# Altium schematic sheet SCore-SR1_2024-11-10.schdoc
size 406 x 260 mm
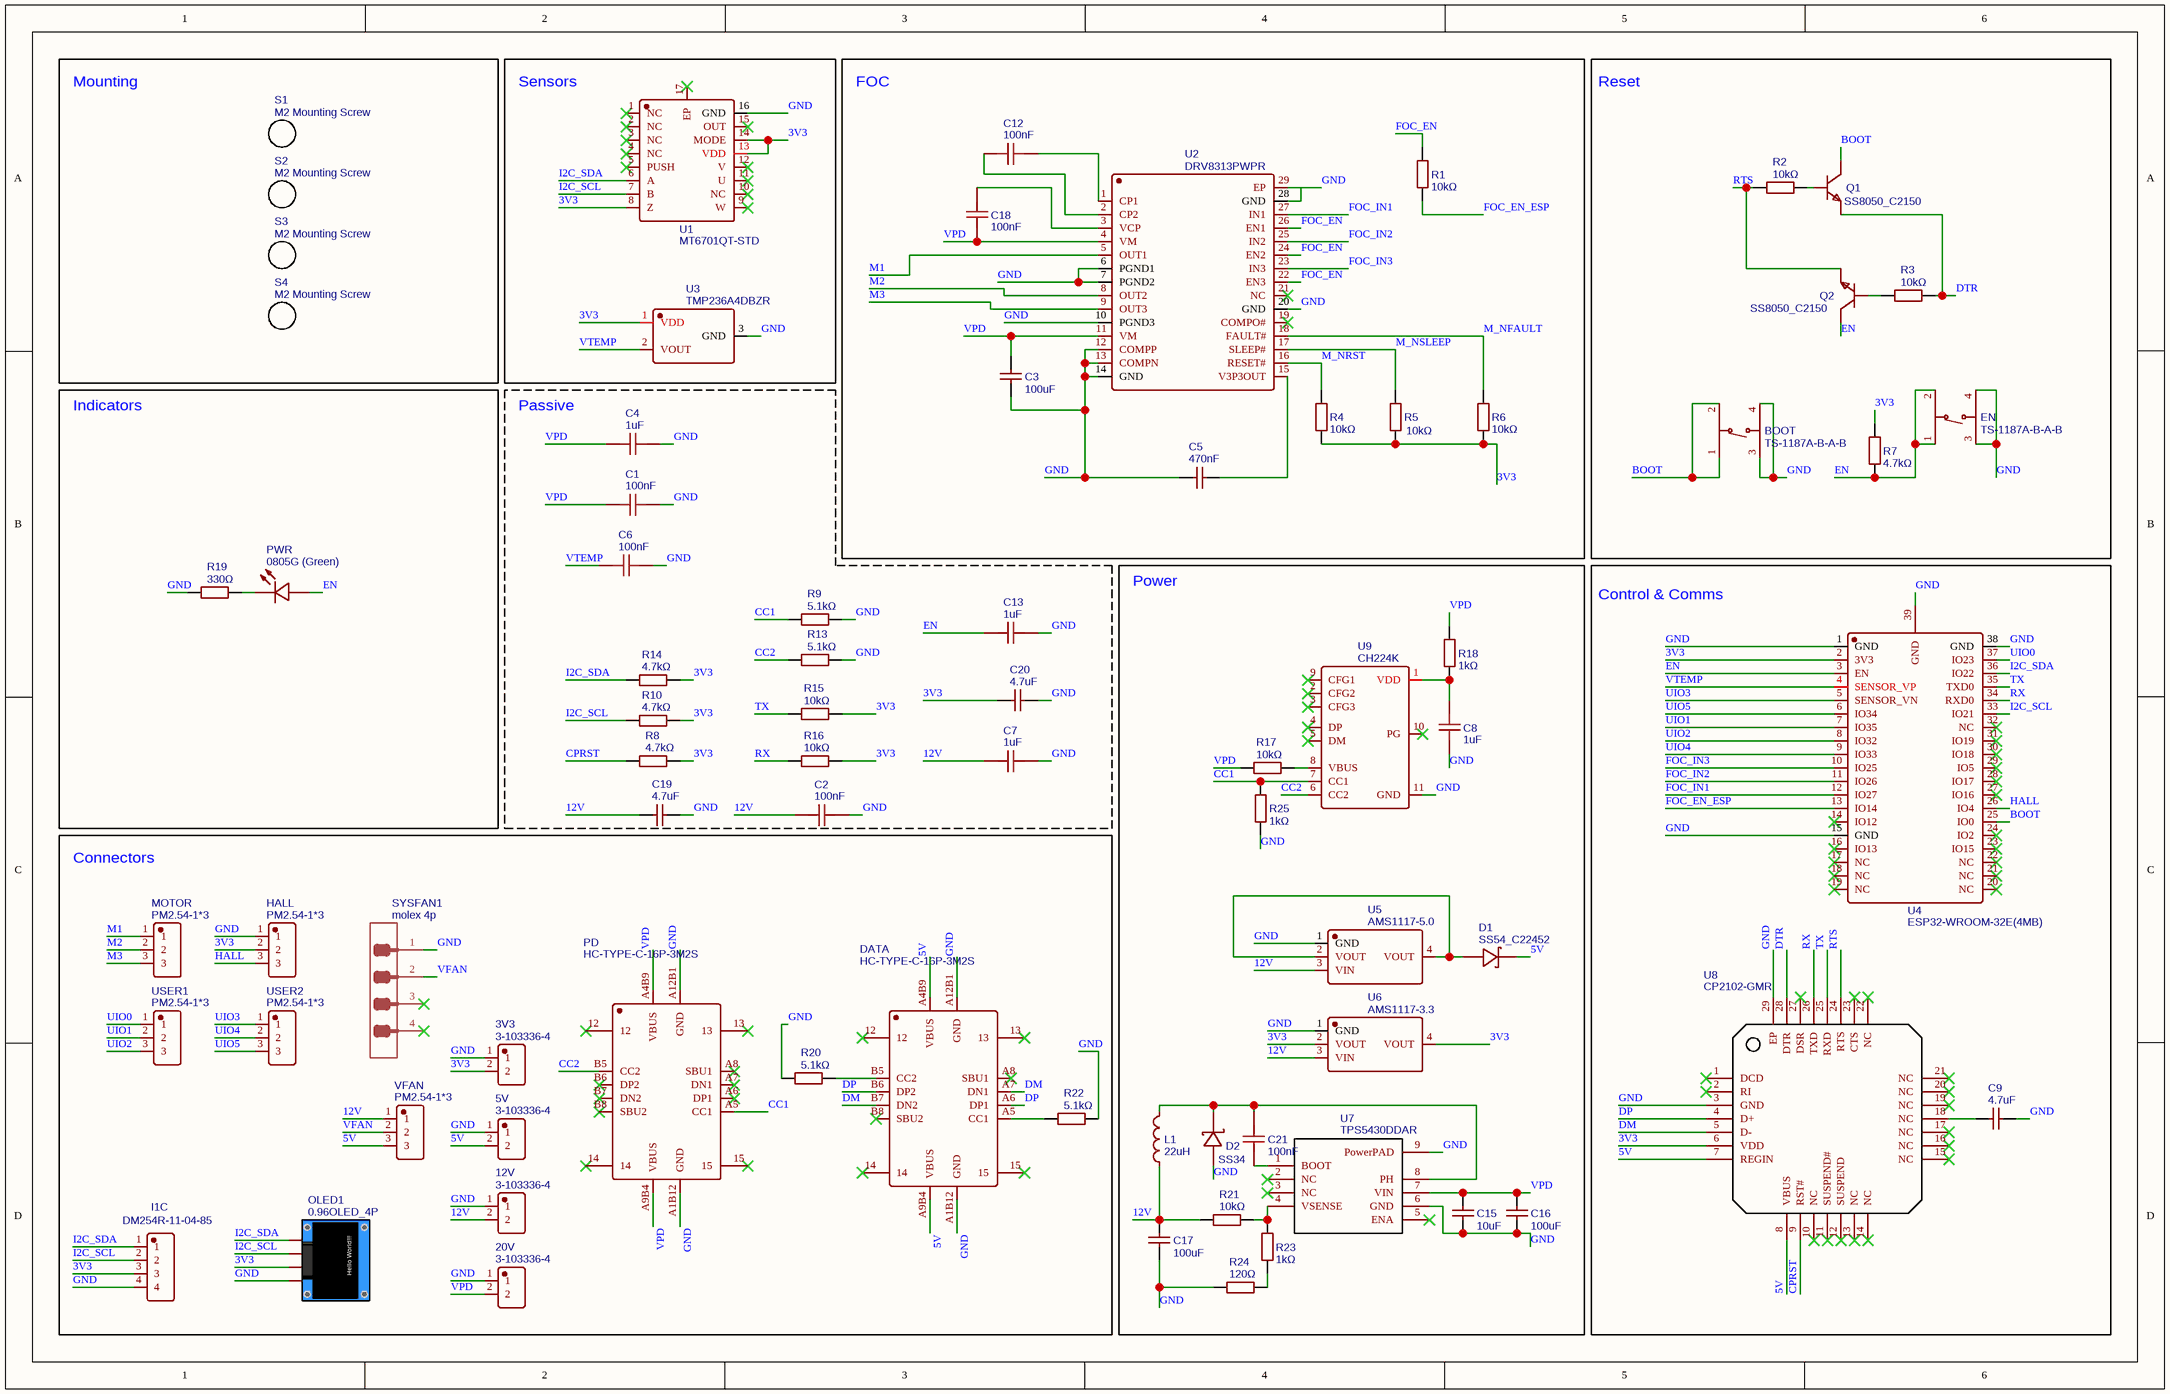
[diagram p0: SCore-SR1_2024-11-10.schdoc]

## Parts
3V3  3-103336-4  [HDR-TH_2P-P2.54-V-M-1]
5V  3-103336-4  [HDR-TH_2P-P2.54-V-M-1]
12V  3-103336-4  [HDR-TH_2P-P2.54-V-M-1]
20V  3-103336-4  [HDR-TH_2P-P2.54-V-M-1]
BOOT  TS-1187A-B-A-B  [SW-SMD_4P-L5.1-W5.1-P3.70-LS6.5-TL-2]
C1  100nF  [C0603]
C2  100nF  [C0603]
C3  100uF  [C1206]
C4  1uF  [C0603]
C5  470nF  [C0805]
C6  100nF  [C0603]
C7  1uF  [C0603]
C8  1uF  [C0603]
C9  4.7uF  [C0805]
C12  100nF  [C0603]
C13  1uF  [C0603]
C15  10uF  [C1206]
C16  100uF  [C1206]
C17  100uF  [C1206]
C18  100nF  [C0603]
C19  4.7uF  [C0805]
C20  4.7uF  [C0805]
C21  100nF  [C0603]
D1  SS54_C22452  [SMA_L4.4-W2.8-LS5.4-R-RD]
D2  SS34  [SMA_L4.3-W2.6-LS5.2-RD]
DATA  HC-TYPE-C-16P-3M2S  [USB-C-SMD_HC-TYPE-C-16P-026W]
EN  TS-1187A-B-A-B  [SW-SMD_4P-L5.1-W5.1-P3.70-LS6.5-TL-2]
HALL  PM2.54-1*3  [HDR-TH_3P-P2.54-V-F]
I1C  DM254R-11-04-85  [HDR-TH_4P-P2.54-V-F]
L1  22uH  [IND-SMD_L4.0-W4.0_PRS4018]
MOTOR  PM2.54-1*3  [HDR-TH_3P-P2.54-V-F]
OLED1  0.96OLED_4P  [HDR-TH_4P-P2.54-V-F-3]
PD  HC-TYPE-C-16P-3M2S  [USB-C-SMD_HC-TYPE-C-16P-026W]
PWR  0805G (Green)  [LED0805-R-RD]
Q1  SS8050_C2150  [SOT-23-3_L2.9-W1.3-P1.90-LS2.4-BR]
Q2  SS8050_C2150  [SOT-23-3_L2.9-W1.3-P1.90-LS2.4-BR]
R1  10kΩ  [R0603]
R2  10kΩ  [R1206]
R3  10kΩ  [R1206]
R4  10kΩ  [R0603]
R5  10kΩ  [R0603]
R6  10kΩ  [R0603]
R7  4.7kΩ  [R0805]
R8  4.7kΩ  [R0805]
R9  5.1kΩ  [R0603]
R10  4.7kΩ  [R0805]
R13  5.1kΩ  [R0603]
R14  4.7kΩ  [R0805]
R15  10kΩ  [R0603]
R16  10kΩ  [R0603]
R17  10kΩ  [R0603]
R18  1kΩ  [R0402]
R19  330Ω  [R0805]
R20  5.1kΩ  [R0603]
R21  10kΩ  [R0805]
R22  5.1kΩ  [R0603]
R23  1kΩ  [R0402]
R24  120Ω  [R0805]
R25  1kΩ  [R0402]
S1  M2 Mounting Screw  [MOUNTINGHOLE_2.2MM_M2_PAD]
S2  M2 Mounting Screw  [MOUNTINGHOLE_2.2MM_M2_PAD]
S3  M2 Mounting Screw  [MOUNTINGHOLE_2.2MM_M2_PAD]
S4  M2 Mounting Screw  [MOUNTINGHOLE_2.2MM_M2_PAD]
SYSFAN1  molex 4p  [MOLEX---47053-1000_MOLEX]
U1  MT6701QT-STD  [QFN-16_L3.0-W3.0-P0.50-TL-EP]
U2  DRV8313PWPR  [HTSSOP-28_L9.8-W4.5-P0.65-LS6.6-BL-EP]
U3  TMP236A4DBZR  [SOT-23-3_L2.9-W1.3-P1.90-LS2.4-BR]
U4  ESP32-WROOM-32E(4MB)  [WIFI-SMD_ESP32-WROOM-32E]
U5  AMS1117-5.0  [SOT-223_L6.5-W3.5-P2.30-LS7.0-BR]
U6  AMS1117-3.3  [SOT-223-3_L6.5-W3.4-P2.30-LS7.0-BR]
U7  TPS5430DDAR  [ESOP-8_L4.9-W3.9-P1.27-LS6.0-TL-EP]
U8  CP2102-GMR  [WQFN-28_L5.0-W5.0-P0.50-BL-EP3.2]
U9  CH224K  [ESSOP-10_L4.9-W3.9-P1.0-LS6.0-TL-EP]
USER1  PM2.54-1*3  [HDR-TH_3P-P2.54-V-F]
USER2  PM2.54-1*3  [HDR-TH_3P-P2.54-V-F]
VFAN  PM2.54-1*3  [HDR-TH_3P-P2.54-V-F]

## Blocks framed on the sheet
Mounting: S1-S4
Sensors: U1 U3
FOC: C3 C5 C12 C18 R1 R4-R6 U2
Reset: BOOT EN Q1 Q2 R2 R3 R7
Indicators: PWR R19
Passive: C1 C2 C4 C6 C7 C13 C19 C20 R8-R10 R13-R16
Power: C8 C15-C17 C21 D1 D2 L1 R17 R18 R21 R23-R25 U5-U7 U9
Control & Comms: C9 U4 U8
Connectors: 3V3 5V 12V 20V DATA HALL I1C MOTOR OLED1 PD R20 R22 SYSFAN1 USER1 USER2 VFAN

## Nets
3V3: 3V3.2 C20.1 HALL.2 I1C.3 OLED1.3 R4.1 R5.1 R6.1 R7.2 R8.1 R10.1 R14.1 R15.1 R16.1 U1.8(Z) U1.13(VDD) U1.14(MODE) U3.1(VDD) U4.2(3V3) U6.2(VOUT) U6.4(VOUT) U8.6(VDD)
5V: 5V.2 D1.2(K) DATA.A4B9(VBUS) DATA.A9B4(VBUS) U8.7(REGIN) U8.8(VBUS) VFAN.3
12V: 12V.2 C2.1 C7.1 C17.2 C19.1 L1.1 R21.2 U5.3(VIN) U6.3(VIN) VFAN.1
BOOT: BOOT.1(A) BOOT.2(B) Q1.3(C) U4.25(IO0)
CC1: PD.A5(CC1) R9.1 R25.2 U9.7(CC1)
CC2: PD.B5(CC2) R13.1 U9.6(CC2)
CPRST: R8.2 U8.9(RST#)
DM: DATA.A7(DN1) DATA.B7(DN2) U8.5(D-)
DP: DATA.A6(DP1) DATA.B6(DP2) U8.4(D+)
DTR: Q1.2(E) R3.2 U8.28(DTR)
EN: C13.1 EN.1(A) EN.2(B) PWR.1(A) Q2.3(C) R7.1 U4.3(EN)
FOC_EN: R1.2 U2.22(EN3) U2.24(EN2) U2.26(EN1)
FOC_EN_ESP: R1.1 U4.13(IO14)
FOC_IN1: U2.27(IN1) U4.12(IO27)
FOC_IN2: U2.25(IN2) U4.11(IO26)
FOC_IN3: U2.23(IN3) U4.10(IO25)
GND: 3V3.1 5V.1 12V.1 20V.1 BOOT.3(C) BOOT.4(D) C1.2 C2.2 C3.1 C4.2 C5.1 C6.2 C7.2 C8.1 C9.2 C13.2 C15.1 C16.1 C17.1 C19.2 C20.2 D2.2(A) DATA.A1B12(GND) DATA.A12B1(GND) EN.3(C) EN.4(D) HALL.1 I1C.4 OLED1.4 PD.A1B12(GND) PD.A12B1(GND) R9.2 R13.2 R19.1 R20.1 R22.2 R24.1 R25.1 SYSFAN1.1 U1.16(GND) U2.6(PGND1) U2.7(PGND2) U2.10(PGND3) U2.12(COMPP) U2.13(COMPN) U2.14(GND) U2.20(GND) U2.28(GND) U2.29(EP) U3.3(GND) U4.1(GND) U4.15(GND) U4.38(GND) U4.39(GND) U5.1(GND) U6.1(GND) U7.6(GND) U7.9(PowerPAD) U8.3(GND) U8.29(EP) U9.11(GND)
HALL: HALL.3 U4.26(IO4)
I2C_SCL: I1C.2 OLED1.2 R10.2 U1.7(B) U4.33(IO21)
I2C_SDA: I1C.1 OLED1.1 R14.2 U1.6(A) U4.36(IO22)
M1: MOTOR.1 U2.5(OUT1)
M2: MOTOR.2 U2.8(OUT2)
M3: MOTOR.3 U2.9(OUT3)
M_NFAULT: R6.2 U2.18(FAULT#)
M_NRST: R4.2 U2.16(RESET#)
M_NSLEEP: R5.2 U2.17(SLEEP#)
RTS: Q2.2(E) R2.1 U8.24(RTS)
RX: R16.2 U4.34(RXD0) U8.26(TXD)
TX: R15.2 U4.35(TXD0) U8.25(RXD)
UIO0: U4.37(IO23) USER1.1
UIO1: U4.7(IO35) USER1.2
UIO2: U4.8(IO32) USER1.3
UIO3: U4.5(SENSOR_VN) USER2.1
UIO4: U4.9(IO33) USER2.2
UIO5: U4.6(IO34) USER2.3
VFAN: SYSFAN1.2 VFAN.2
VPD: 20V.2 C1.1 C3.2 C4.1 C15.2 C16.2 C18.1 PD.A4B9(VBUS) PD.A9B4(VBUS) R17.2 R18.2 U2.4(VM) U2.11(VM) U7.7(VIN)
VTEMP: C6.1 U3.2(VOUT) U4.4(SENSOR_VP)
NetC5_2: C5.2 U2.15(V3P3OUT)
NetC8_2: C8.2 R18.1 U9.1(VDD)
NetC9_1: C9.1 U8.18(NC)
NetC12_1: C12.1 U2.2(CP2)
NetC12_2: C12.2 U2.1(CP1)
NetC18_2: C18.2 U2.3(VCP)
NetC21_1: C21.1 D2.1(K) L1.2 U7.8(PH)
NetC21_2: C21.2 U7.1(BOOT)
NetD1_1: D1.1(A) U5.2(VOUT) U5.4(VOUT)
NetDATA_A5: DATA.A5(CC1) R22.1
NetDATA_B5: DATA.B5(CC2) R20.2
NetPWR_2: PWR.2(K) R19.2
NetQ1_1: Q1.1(B) R2.2
NetQ2_1: Q2.1(B) R3.1
NetR17_1: R17.1 U9.8(VBUS)
NetR21_1: R21.1 R23.2 U7.4(VSENSE)
NetR23_1: R23.1 R24.2

Not connected (* = marked no-connect by the designer): DATA 12* 13* 14* 15* A8(SBU1)* B8(SBU2)*; PD 12* 13* 14* 15* A6(DP1)* A7(DN1)* A8(SBU1)* B6(DP2)* B7(DN2)* B8(SBU2)*; SYSFAN1 3* 4*; U1 1(NC)* 2(NC)* 3(NC)* 4(NC)* 5(PUSH)* 9(W)* 10(NC)* 11(U)* 12(V)* 15(OUT)* 17(EP)*; U2 19(COMPO#)* 21(NC)*; U4 14(IO12)* 16(IO13)* 17(NC)* 18(NC)* 19(NC)* 20(NC)* 21(NC)* 22(NC)* 23(IO15)* 24(IO2)* 27(IO16)* 28(IO17)* 29(IO5)* 30(IO18)* 31(IO19)* 32(NC)*; U7 2(NC)* 3(NC)* 5(ENA)*; U8 1(DCD)* 2(RI)* 10(NC)* 11(SUSPEND#)* 12(SUSPEND)* 13(NC)* 14(NC)* 15(NC)* 16(NC)* 17(NC)* 19(NC)* 20(NC)* 21(NC)* 22(NC)* 23(CTS)* 27(DSR)*; U9 2(CFG2)* 3(CFG3)* 4(DP)* 5(DM)* 9(CFG1)* 10(PG)*

## Notes on the sheet
- (in symbol 0.96OLED_4P) Hello World!!!

## Library data of the parts
3V3 5V 12V 20V = 3-103336-4: Manufacturer: TE Connectivity(泰科电子); Contributor: lcsc; Supplier: LCSC; Supplier Part: C6802999; Manufacturer Part: 3-103336-4; spicePre: U; spiceSymbolName: 3-103336-4
BOOT EN = TS-1187A-B-A-B: Manufacturer: XKB Connectivity(中国星坤); Contributor: LCSC; Supplier: LCSC; Supplier Part: C318884; Manufacturer Part: TS-1187A-B-A-B; JLCPCB Part Class: Basic Part; spicePre: S; spiceSymbolName: TS-1187A-B-A-B
C1 C2 C6 C12 C18 C21 = 100nF: Manufacturer: YAGEO(国巨); Manufacturer Part: CC0603KRX7R9BB104; nameAlias: Value; Supplier: LCSC; Supplier Part: C14663; JLCPCB Part Class: Basic Part; spicePre: C; spiceSymbolName: CC0603KRX7R9BB104
C3 C16 C17 = 100uF: Manufacturer Part: CL31A107MQHNNNE; Manufacturer: SAMSUNG(三星); nameAlias: Value; Supplier: LCSC; Supplier Part: C15008; JLCPCB Part Class: Basic Part; spicePre: C; spiceSymbolName: CL31A107MQHNNNE
C4 C7 C8 C13 = 1uF: Manufacturer Part: CL10A105KB8NNNC; Manufacturer: SAMSUNG(三星); nameAlias: Value; Supplier: LCSC; Supplier Part: C15849; JLCPCB Part Class: Basic Part; spicePre: C; spiceSymbolName: CL10A105KB8NNNC
C5 = 470nF: Manufacturer Part: CL21B474KBFNNNE; Manufacturer: SAMSUNG(三星); nameAlias: Capacitance; Contributor: eisendev; Supplier: LCSC; Supplier Part: C13967; JLCPCB Part Class: Basic Part; spicePre: C; spiceSymbolName: CL21B474KBFNNNE
C9 C19 C20 = 4.7uF: Manufacturer Part: CL21A475KAQNNNE; Manufacturer: SAMSUNG(三星); nameAlias: Value; Supplier: LCSC; Supplier Part: C1779; JLCPCB Part Class: Basic Part; spicePre: C; spiceSymbolName: CL21A475KAQNNNE
C15 = 10uF: Manufacturer Part: CL31A106KBHNNNE; Manufacturer: SAMSUNG(三星); nameAlias: Value; Supplier: LCSC; Supplier Part: C13585; JLCPCB Part Class: Basic Part; spicePre: C; spiceSymbolName: CL31A106KBHNNNE
D1 = SS54_C22452: Manufacturer Part: SS54; Manufacturer: MDD; Contributor: mtz8302; Supplier: LCSC; Supplier Part: C22452; JLCPCB Part Class: Basic Part; link: https://lcsc.com/eda_search?q=C22452&%26type=1&ref=editor; spicePre: D; spiceSymbolName: SS54_C22452
D2 = SS34: Manufacturer: MDD(辰达半导体); Supplier: LCSC; Manufacturer Part: SS34; Supplier Part: C8678; JLCPCB Part Class: Basic Part; spicePre: D; spiceSymbolName: SS34_C8678
DATA PD = HC-TYPE-C-16P-3M2S: Manufacturer: HC(虹成电子); Contributor: lcsc; Supplier: LCSC; Supplier Part: C19274016; Manufacturer Part: HC-TYPE-C-16P-3M2S; JLCPCB Part Class: Extended Part; spicePre: U; spiceSymbolName: HC-TYPE-C-16P-3M2S
HALL MOTOR USER1 USER2 VFAN = PM2.54-1*3: Manufacturer: ZHOURI(洲日); Contributor: lcsc; Supplier: LCSC; Supplier Part: C5116529; Manufacturer Part: PM2.54-1*3; JLCPCB Part Class: Extended Part; spicePre: U; spiceSymbolName: PM2.54-1*3
I1C = DM254R-11-04-85: Manufacturer: DEALON(德艺隆); Contributor: LCSC; Supplier: LCSC; Supplier Part: C2935975; Manufacturer Part: DM254R-11-04-85; JLCPCB Part Class: Extended Part; spicePre: U; spiceSymbolName: DM254R-11-04-85
L1 = 22uH: Manufacturer: FH(风华); Manufacturer Part: PRS4018-220MT; nameAlias: Value; Supplier: LCSC; Supplier Part: C96155; JLCPCB Part Class: Extended Part; spicePre: L; spiceSymbolName: PRS4018-220MT
OLED1 = 0.96OLED_4P: Contributor: LCEDA_Lib; Supplier: LCSC; spicePre: O; spiceSymbolName: 0.96OLED_4P
PWR = 0805G (Green): Manufacturer: KENTO; Manufacturer Part: KT-0805G; Supplier: LCSC; Supplier Part: C2297; JLCPCB Part Class: Basic Part; spicePre: L; spiceSymbolName: 0805G (Green)
Q1 Q2 = SS8050_C2150: Manufacturer: CJ(江苏长电/长晶); Manufacturer Part: SS8050; Supplier: LCSC; Supplier Part: C2150; JLCPCB Part Class: Basic Part; spicePre: Q; spiceSymbolName: SS8050_C2150
R1 R4-R6 R15-R17 = 10kΩ: Manufacturer: UniOhm; Manufacturer Part: 0603WAF4701T5E; nameAlias: Resistance; Resistance (Ohms): 4.7K; Supplier: LCSC; Supplier Part: C23162; JLCPCB Part Class: Basic Part; spicePre: R; spiceSymbolName: 0603WAF4701T5E
R2 R3 = 10kΩ: Manufacturer: UNI-ROYAL(厚声); Manufacturer Part: 1206W4F1002T5E; nameAlias: Value; Supplier: LCSC; Supplier Part: C17902; JLCPCB Part Class: Basic Part; spicePre: R; spiceSymbolName: 1206W4F1002T5E
R7 R8 R10 R14 = 4.7kΩ: Manufacturer: UNI-ROYAL(厚声); Manufacturer Part: 0805W8F4701T5E; nameAlias: Value; Supplier: LCSC; Supplier Part: C17673; JLCPCB Part Class: Basic Part; spicePre: R; spiceSymbolName: 0805W8F4701T5E
R9 R13 R20 R22 = 5.1kΩ: Manufacturer Part: 0603WAF5101T5E; Manufacturer: UNI-ROYAL(厚声); nameAlias: Value; Supplier: LCSC; Supplier Part: C23186; JLCPCB Part Class: Basic Part; spicePre: R; spiceSymbolName: 0603WAF5101T5E
R18 R23 R25 = 1kΩ: Manufacturer: UNI-ROYAL(厚声); Manufacturer Part: 0402WGF1001TCE; nameAlias: Value; Supplier: LCSC; Supplier Part: C11702; JLCPCB Part Class: Basic Part; spicePre: R; spiceSymbolName: 0402WGF1001TCE
R19 = 330Ω: Manufacturer: UNI-ROYAL(厚声); Manufacturer Part: 0805W8F3300T5E; nameAlias: Value; Supplier: LCSC; Supplier Part: C17630; JLCPCB Part Class: Basic Part; spicePre: R; spiceSymbolName: 0805W8F3300T5E
R21 = 10kΩ: Manufacturer: UNI-ROYAL(厚声); Manufacturer Part: 0805W8F1002T5E; nameAlias: Value; Supplier: LCSC; Supplier Part: C17414; JLCPCB Part Class: Basic Part; spicePre: R; spiceSymbolName: 0805W8F1002T5E
R24 = 120Ω: Manufacturer: UNI-ROYAL(厚声); Manufacturer Part: 0805W8F1200T5E; nameAlias: Value; Supplier: LCSC; Supplier Part: C17437; JLCPCB Part Class: Basic Part; spicePre: R; spiceSymbolName: 0805W8F1200T5E
S1-S4 = M2 Mounting Screw: Contributor: Dayat -; spicePre: S; spiceSymbolName: M2 Mounting Screw
SYSFAN1 = molex 4p: Contributor: delil1220; spicePre: J; spiceSymbolName: molex 4p
U1 = MT6701QT-STD: Manufacturer: MagnTek(麦歌恩); Contributor: LCSC; Supplier: LCSC; Supplier Part: C2837232; Manufacturer Part: MT6701QT-STD; JLCPCB Part Class: Extended Part; spicePre: U; spiceSymbolName: MT6701QT-STD
U2 = DRV8313PWPR: Manufacturer: Texas Instruments; Contributor: LCSC; Supplier: LCSC; Supplier Part: C92482; Manufacturer Part: DRV8313PWPR; JLCPCB Part Class: Extended Part; spicePre: U; spiceSymbolName: DRV8313PWPR
U3 = TMP236A4DBZR: Manufacturer: TI(德州仪器); Contributor: LCSC; Supplier: LCSC; Supplier Part: C2872164; Manufacturer Part: TMP236A4DBZR; JLCPCB Part Class: Extended Part; spicePre: U; spiceSymbolName: TMP236A4DBZR
U4 = ESP32-WROOM-32E(4MB): Manufacturer: ESPRESSIF(乐鑫); Manufacturer Part: ESP32-WROOM-32E-N4; Contributor: LCSC; Supplier: LCSC; Supplier Part: C701341; JLCPCB Part Class: Extended Part; spicePre: U; spiceSymbolName: ESP32-WROOM-32E(4MB)
U5 = AMS1117-5.0: Manufacturer: AMS; sourceId: HltLFyQwq; timeStamp: 1466676067; Supplier: LCSC; Manufacturer Part: AMS1117-5.0; Supplier Part: C6187; JLCPCB Part Class: Basic Part; spicePre: U; spiceSymbolName: AMS1117-5.0
U6 = AMS1117-3.3: Manufacturer: AMS; sourceId: dwIGgezVh; timeStamp: 1476261164; Supplier: LCSC; Manufacturer Part: AMS1117-3.3; Supplier Part: C6186; JLCPCB Part Class: Basic Part; spicePre: U; spiceSymbolName: AMS1117-3.3
U7 = TPS5430DDAR: Manufacturer: TI(德州仪器); Supplier: LCSC; Manufacturer Part: TPS5430DDAR; Supplier Part: C9864; JLCPCB Part Class: Basic Part; spicePre: U; spiceSymbolName: TPS5430DDAR
U8 = CP2102-GMR: Manufacturer: SKYWORKS/SILICON LABS(芯科); Supplier: LCSC; Manufacturer Part: CP2102-GMR; Supplier Part: C6568; JLCPCB Part Class: Extended Part; spicePre: U; spiceSymbolName: CP2102-GMR
U9 = CH224K: Manufacturer: WCH(南京沁恒); Contributor: lcsc; Supplier: LCSC; Supplier Part: C970725; Manufacturer Part: CH224K; JLCPCB Part Class: Extended Part; spicePre: U; spiceSymbolName: CH224K